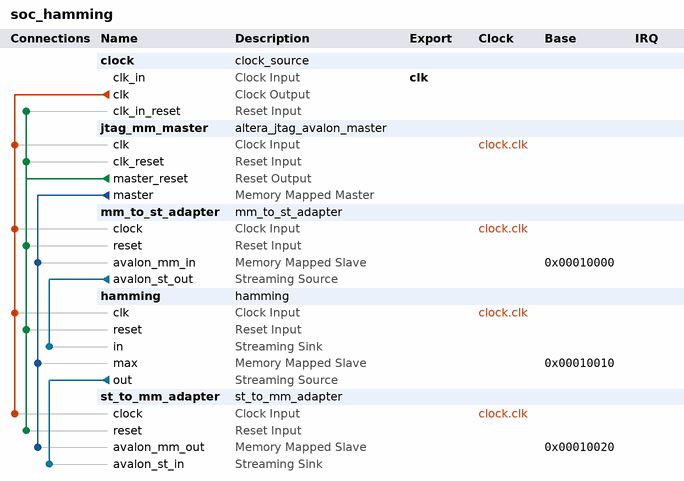
[diagram p0: system contents]
# Platform Designer (Qsys) system soc_hamming, Cyclone V 5CSXFC6C6U23C8ES
# Parameters at their usual value, and those the tool derives, are not listed.
package require -exact qsys 13.1
create_system soc_hamming
set_project_property DEVICE_FAMILY {Cyclone V}
set_project_property DEVICE 5CSXFC6C6U23C8ES

add_instance clock clock_source 13.1
set_instance_parameter_value clock clockFrequency 50000000

add_instance jtag_mm_master altera_jtag_avalon_master 13.1

add_instance mm_to_st_adapter mm_to_st_adapter 1.0
set_instance_parameter_value mm_to_st_adapter WIDTH 8

add_instance hamming hamming 1.0

add_instance st_to_mm_adapter st_to_mm_adapter 1.0
set_instance_parameter_value st_to_mm_adapter WIDTH 8

# connections
add_connection clock.clk hamming.clk clock
add_connection clock.clk jtag_mm_master.clk clock
add_connection clock.clk mm_to_st_adapter.clock clock
add_connection clock.clk st_to_mm_adapter.clock clock
add_connection jtag_mm_master.master_reset clock.clk_in_reset reset
add_connection jtag_mm_master.master_reset hamming.reset reset
add_connection jtag_mm_master.master_reset jtag_mm_master.clk_reset reset
add_connection jtag_mm_master.master_reset mm_to_st_adapter.reset reset
add_connection jtag_mm_master.master_reset st_to_mm_adapter.reset reset
add_connection jtag_mm_master.master hamming.max avalon
set_connection_parameter_value jtag_mm_master.master/hamming.max baseAddress 0x00010010
add_connection jtag_mm_master.master mm_to_st_adapter.avalon_mm_in avalon
set_connection_parameter_value jtag_mm_master.master/mm_to_st_adapter.avalon_mm_in baseAddress 0x00010000
add_connection jtag_mm_master.master st_to_mm_adapter.avalon_mm_out avalon
set_connection_parameter_value jtag_mm_master.master/st_to_mm_adapter.avalon_mm_out baseAddress 0x00010020
add_connection hamming.out st_to_mm_adapter.avalon_st_in avalon_streaming
add_connection mm_to_st_adapter.avalon_st_out hamming.in avalon_streaming

# exported interfaces
add_interface clk clock sink
set_interface_property clk EXPORT_OF clock.clk_in

set_interconnect_requirement {$system} qsys_mm.clockCrossingAdapter HANDSHAKE
set_interconnect_requirement {$system} qsys_mm.maxAdditionalLatency 1
set_interconnect_requirement {$system} qsys_mm.insertDefaultSlave false

save_system soc_hamming.qsys
